# Altium schematic sheet Audio_stuff_CH.SchDoc
size A; SheetNumber: 2; SheetTotal: 7
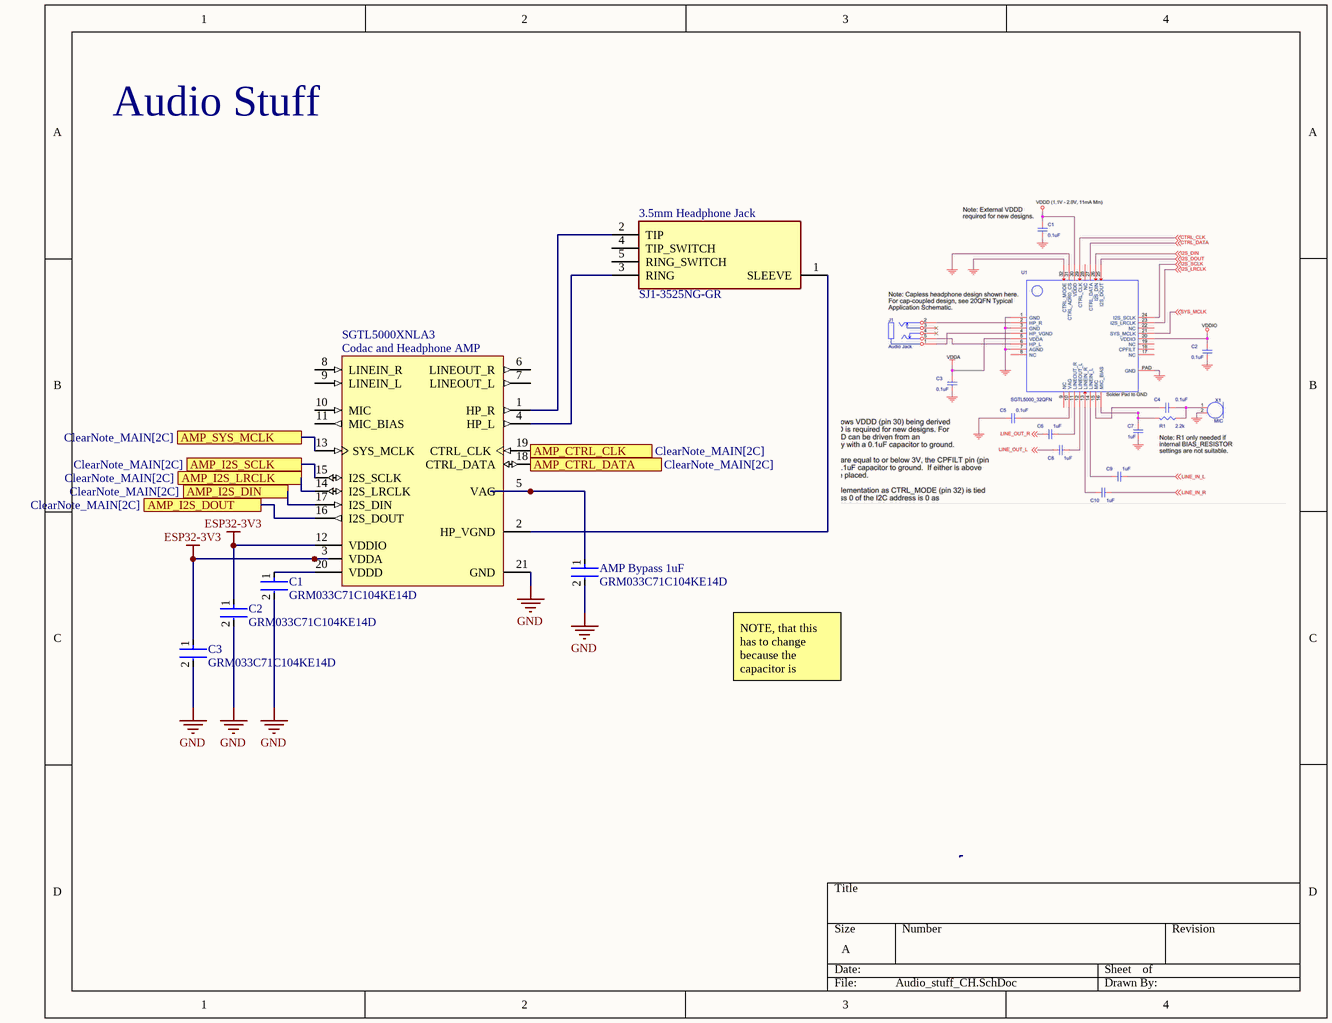
[diagram p0: Audio_stuff_CH.SchDoc]

## Parts
3.5mm_Headphone_Jack  SJ1-3525NG-GR  [SJ13525NGGR]
AMP_Bypass_1uF  GRM033C71C104KE14D  [FP-GRM033-0_03-MFG]
C1  GRM033C71C104KE14D  [FP-GRM033-0_03-MFG]
C2  GRM033C71C104KE14D  [FP-GRM033-0_03-MFG]
C3  GRM033C71C104KE14D  [FP-GRM033-0_03-MFG]
Codac_and_Headphone_AMP  SGTL5000XNLA3  [FRES-2032-01_N]

## Ports
AMP_CTRL_CLK (see ClearNote_MAIN[2C]), AMP_CTRL_DATA (see ClearNote_MAIN[2C]), AMP_I2S_DIN (see ClearNote_MAIN[2C]), AMP_I2S_DOUT (see ClearNote_MAIN[2C]), AMP_I2S_LRCLK (see ClearNote_MAIN[2C]), AMP_I2S_SCLK (see ClearNote_MAIN[2C]), AMP_SYS_MCLK (see ClearNote_MAIN[2C])

## Nets
ESP32-3V3: C2.1 C3.1 Codac_and_Headphone_AMP.3(VDDA) Codac_and_Headphone_AMP.12(VDDIO)
GND: AMP_Bypass_1uF.2 C1.2 C2.2 C3.2 Codac_and_Headphone_AMP.21(GND)
AMP_CTRL_CLK: Codac_and_Headphone_AMP.19(CTRL_CLK) ; port AMP_CTRL_CLK
AMP_CTRL_DATA: Codac_and_Headphone_AMP.18(CTRL_DATA) ; port AMP_CTRL_DATA
AMP_I2S_DIN: Codac_and_Headphone_AMP.17(I2S_DIN) ; port AMP_I2S_DIN
AMP_I2S_DOUT: Codac_and_Headphone_AMP.16(I2S_DOUT) ; port AMP_I2S_DOUT
AMP_I2S_LRCLK: Codac_and_Headphone_AMP.14(I2S_LRCLK) ; port AMP_I2S_LRCLK
AMP_I2S_SCLK: Codac_and_Headphone_AMP.15(I2S_SCLK) ; port AMP_I2S_SCLK
AMP_SYS_MCLK: Codac_and_Headphone_AMP.13(SYS_MCLK) ; port AMP_SYS_MCLK
Net3.5mm_Headphone_Jack_1: 3.5mm_Headphone_Jack.1(SLEEVE) Codac_and_Headphone_AMP.2(HP_VGND)
Net3.5mm_Headphone_Jack_2: 3.5mm_Headphone_Jack.2(TIP) Codac_and_Headphone_AMP.1(HP_R)
Net3.5mm_Headphone_Jack_3: 3.5mm_Headphone_Jack.3(RING) Codac_and_Headphone_AMP.4(HP_L)
NetAMP_Bypass_1uF_1: AMP_Bypass_1uF.1 Codac_and_Headphone_AMP.5(VAG)
NetC1_1: C1.1 Codac_and_Headphone_AMP.20(VDDD)

Not connected (* = marked no-connect by the designer): 3.5mm_Headphone_Jack 4(TIP_SWITCH) 5(RING_SWITCH); Codac_and_Headphone_AMP 6(LINEOUT_R) 7(LINEOUT_L) 8(LINEIN_R) 9(LINEIN_L) 10(MIC) 11(MIC_BIAS)

## Notes on the sheet
- Audio Stuff
- NOTE, that this has to change because the capacitor is already a .1uF capacitor I am pretty sure.

## Library data of the parts
3.5mm_Headphone_Jack = SJ1-3525NG-GR: Connector; Manufacturer_Name: Same Sky; Datasheet Link: https://www.sameskydevices.com/product/resource/sj1-352xng.pdf; Height: 6.1mm; Manufacturer_Part_Number: SJ1-3525NG-GR; Mouser Part Number: 490-SJ1-3525NG-GR; Mouser Price/Stock: https://www.mouser.co.uk/ProductDetail/Same-Sky/SJ1-3525NG-GR?qs=WyjlAZoYn51BeLQaUbXH3w%3D%3D; Arrow Part Number: SJ1-3525NG-GR; Arrow Price/Stock: https://www.arrow.com/en/products/sj1-3525ng-gr/same-sky-(formerly-cui-devices)?utm_currency=USD&region=nac
AMP_Bypass_1uF C1-C3 = CMP-06035-019037-1: Chip Multilayer Ceramic Capacitors for General Purpose, 0201, 0.10uF, X7S, 22%, 10%, 16V; Capacitance: 100nF; Dielectric: X7S; Tolerance: 10%; Voltage Rating (DC): 16V; Height: 0.3mm; Max Operating Temperature: 125°C; Case Code (Metric): 0603; Termination: SMD/SMT; Min Operating Temperature: -55°C; Mount: Surface Mount; Case/Package: 0201; Weight: 1.2E-05oz; Package Quantity: 15000; Length: 0.024inch; Voltage Rating: 16V; Case Code (Imperial): 0201; Packaging: Tape and Reel; Thickness: 0.013inch; Width: 0.3mm
Codac_and_Headphone_AMP = CMP-1078-00003-1: Low Power Stereo Codec with Headphone Amp, 1.1 to 2 V, -40 to 85 degC, 20-Pin QFN-EP, RoHS, Tray; Manufacturer: Freescale Semiconductor; SYS_MCLK Rise/Fall Time: 0.5 to 10 ns; VDDIO(V): 1.62 to 3.6; VDDD(V): 1.1 to 2; MIC Input Impedance: 2.9 KOhm Typ.; LINEOUT Output Impedance: 320 Ohm Typ.; ComponentLink1URL: http://www.freescale.com/; ComponentLink3URL: http://cache.freescale.com/files/shared/doc/package_info/98ARE10742D.pdf?&Parent_nodeId=&Parent_pageType=; Mounting Technology: Surface Mount; PackageDescription: 20-Pin Thermally Enhanced Quad Flat Non-Lead Package(QFN), Body 3 x 3 mm, Pitch 0.4 mm; PartNumber: SGTL5000XNLA3; ComponentLink2Description: Datasheet; Packing: Tray; PackageVersion: Rev. O; RoHS: TRUE; DatasheetVersion: Rev. 6.0; ComponentLink1Description: Manufacturer URL; ComponentLink3Description: Package Specification; ComponentLink2URL: http://cache.freescale.com/files/analog/doc/data_sheet/SGTL5000.pdf?pspll=1&Parent_nodeId=1227651963351723867067&Parent_pageType=product; PackageReference: 2032-01; Temperature Range: -40 to 85 degC